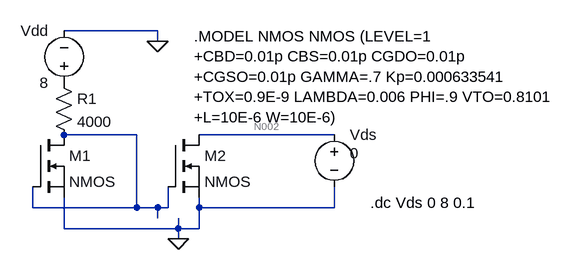
[diagram p0: schematic fourth.asc]
fourth.asc, the LTspice schematic file:
Version 4
SHEET 1 940 680
WIRE 288 -32 144 -32
WIRE 288 -16 288 -32
WIRE 256 128 144 128
WIRE 560 128 352 128
WIRE 96 240 96 208
WIRE 256 240 256 128
WIRE 256 240 96 240
WIRE 288 240 256 240
WIRE 304 240 304 208
WIRE 304 240 288 240
WIRE 352 240 352 224
WIRE 560 240 560 208
WIRE 560 240 352 240
WIRE 288 256 288 240
WIRE 144 272 144 224
WIRE 320 272 320 256
WIRE 320 272 144 272
WIRE 352 272 352 240
WIRE 352 272 320 272
WIRE 320 288 320 272
FLAG 320 288 0
FLAG 288 -16 0
SYMBOL nmos 96 128 R0
SYMATTR InstName M1
SYMBOL nmos 304 128 R0
SYMATTR InstName M2
SYMBOL res 128 32 R0
SYMATTR InstName R1
SYMATTR Value 4000
SYMBOL voltage 144 64 R180
WINDOW 0 24 96 Left 2
WINDOW 3 24 16 Left 2
SYMATTR InstName Vdd
SYMATTR Value 8
SYMBOL voltage 560 112 R0
WINDOW 3 24 44 Left 2
WINDOW 123 0 0 Left 0
WINDOW 39 0 0 Left 0
SYMATTR Value 0
SYMATTR InstName Vds
TEXT 344 -24 Left 2 !.MODEL NMOS NMOS (LEVEL=1 \n+CBD=0.01p CBS=0.01p CGDO=0.01p \n+CGSO=0.01p GAMMA=.7 Kp=0.000633541\n+TOX=0.9E-9 LAMBDA=0.006 PHI=.9 VTO=0.8101\n+L=10E-6 W=10E-6)
TEXT 616 232 Left 2 !.dc Vds 0 8 0.1

The netlist it stands for:
* fourth.asc
M1 N001 N001 0 0 NMOS
M2 N002 N001 0 0 NMOS
R1 P001 N001 4000
Vdd P001 0 8
Vds N002 0 0
.model NMOS NMOS
.model PMOS PMOS
.lib standard.mos
.MODEL NMOS NMOS (LEVEL=1
+CBD=0.01p CBS=0.01p CGDO=0.01p
+CGSO=0.01p GAMMA=.7 Kp=0.000633541
+TOX=0.9E-9 LAMBDA=0.006 PHI=.9 VTO=0.8101
+L=10E-6 W=10E-6)
.dc Vds 0 8 0.1
.backanno
.end

* Results of the author's LTspice run, read from the files saved beside the schematic
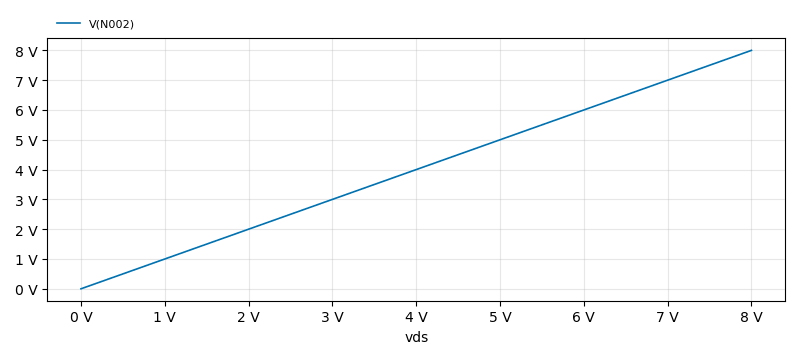
[diagram p1: DC transfer characteristic of fourth.asc, plotted from the saved traces]
* DC transfer characteristic, 1 run:
*   V(N002): 0 V at vds=0 V, 8 V at vds=8 V, min 0 V, max 8 V